# EAGLE schematic untitled (EAGLE 8.3.2)
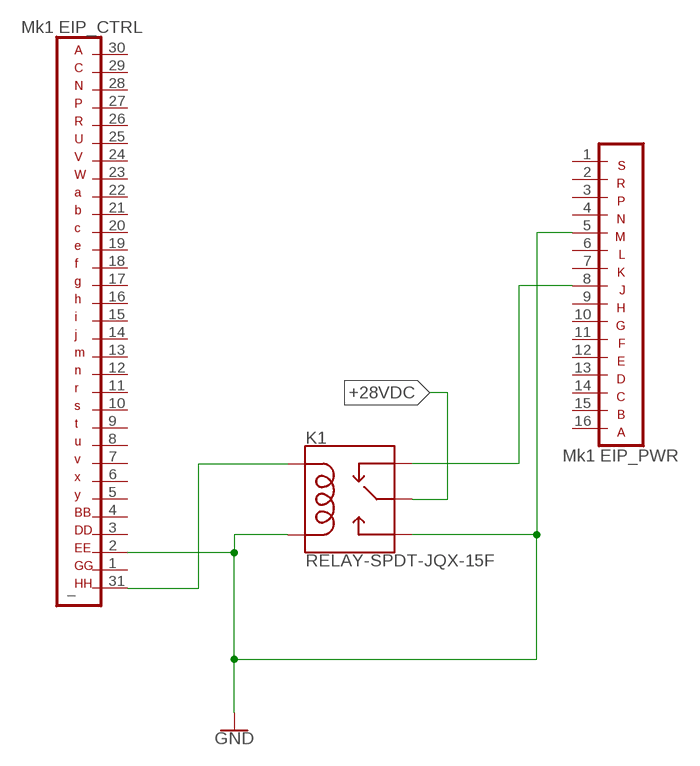
[diagram p0: schematic, sheet 1]

## Parts
J2  SDGDSGG  [1X30]
K1  RELAY-SPDT-JQX-15F  [RELAY-T90]
U$1  MK1_EIP_PWR  [1X16]

## Nets
+28VDC: K1.MAIN
GND: J2.2 K1.COIL2 K1.NO U$1.5
N$1: J2.31(_) K1.COIL1
N$2: K1.NC U$1.8
Unconnected: J2.1 J2.3 J2.4 J2.5 J2.6 J2.7 J2.8 J2.9 J2.10 J2.11 J2.12 J2.13 J2.14 J2.15 J2.16 J2.17 J2.18 J2.19 J2.20 J2.21 J2.22 J2.23 J2.24 J2.25 J2.26 J2.27 J2.28 J2.29 J2.30 U$1.1 U$1.2 U$1.3 U$1.4 U$1.6 U$1.7 U$1.9 U$1.10 U$1.11 U$1.12 U$1.13 U$1.14 U$1.15 U$1.16

## Library data of the parts
J2 = madHaddr:SDGDSGG
K1 = SparkFun-Electromechanical:RELAY-SPDT: SPDT Electromechanical Relay Single-pole, double-throw sealed relays. When current is applied to the coil, it throws a simple changeover switch, terminating the connection from the NC contact to ground and closing the NO contact. Use them to switch high voltage/high current devices. SparkFun Products JQX-15F: Relay SPDT Sealed - 20A <https://www.sparkfun.com/products/10924> (COM-10924) JZC-11F: Relay SPDT Sealed <https://www.sparkfun.com/products/100> (COM-00100); PROD_ID: COMP-10736; SF_SKU: COM-10924
U$1 = madHaddr:MK1_EIP_PWR